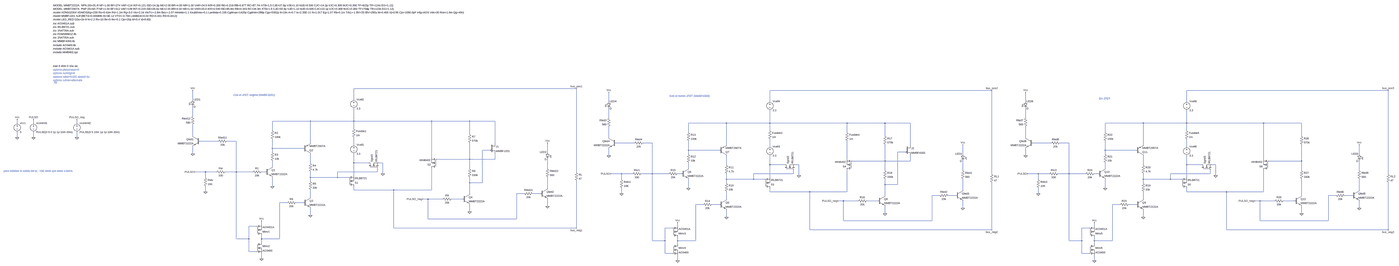
[diagram p0: schematic Prueba JFETs.asc, whole sheet]
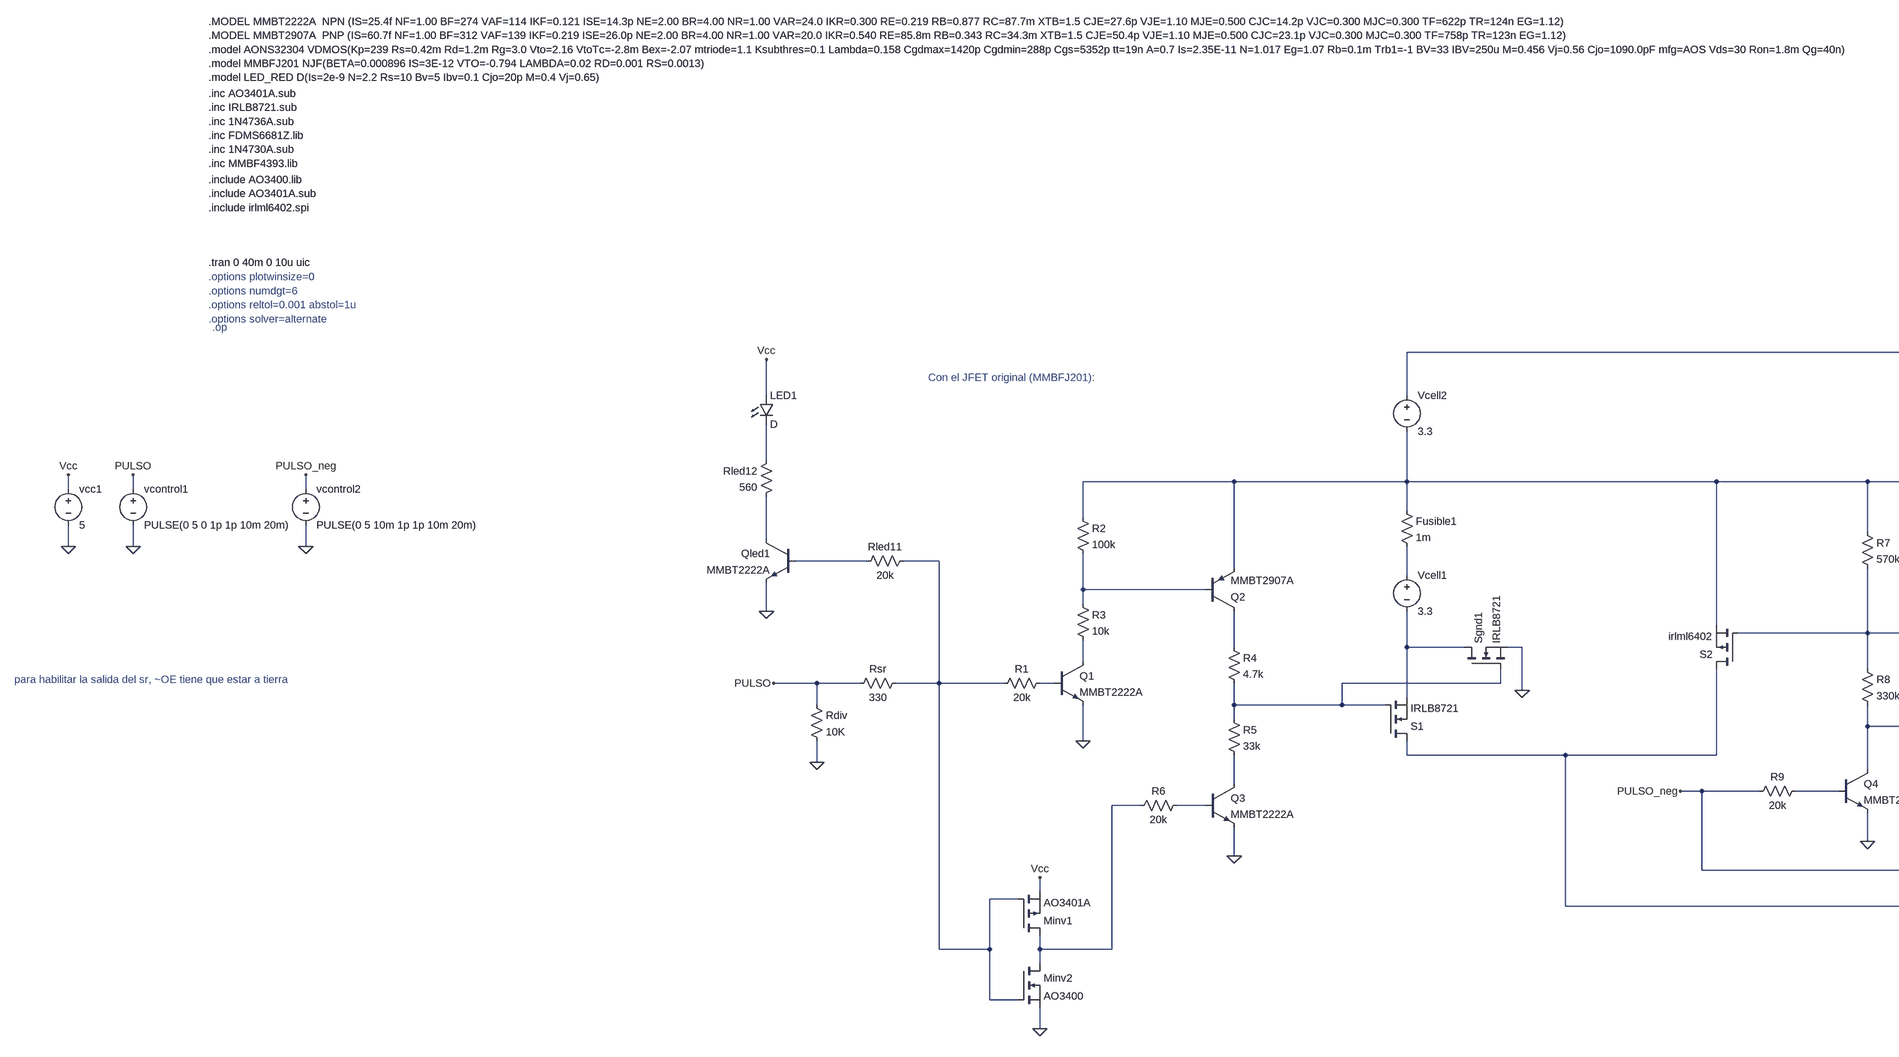
[diagram p1: schematic Prueba JFETs.asc, part, row 1 of 1, column 1 of 3]
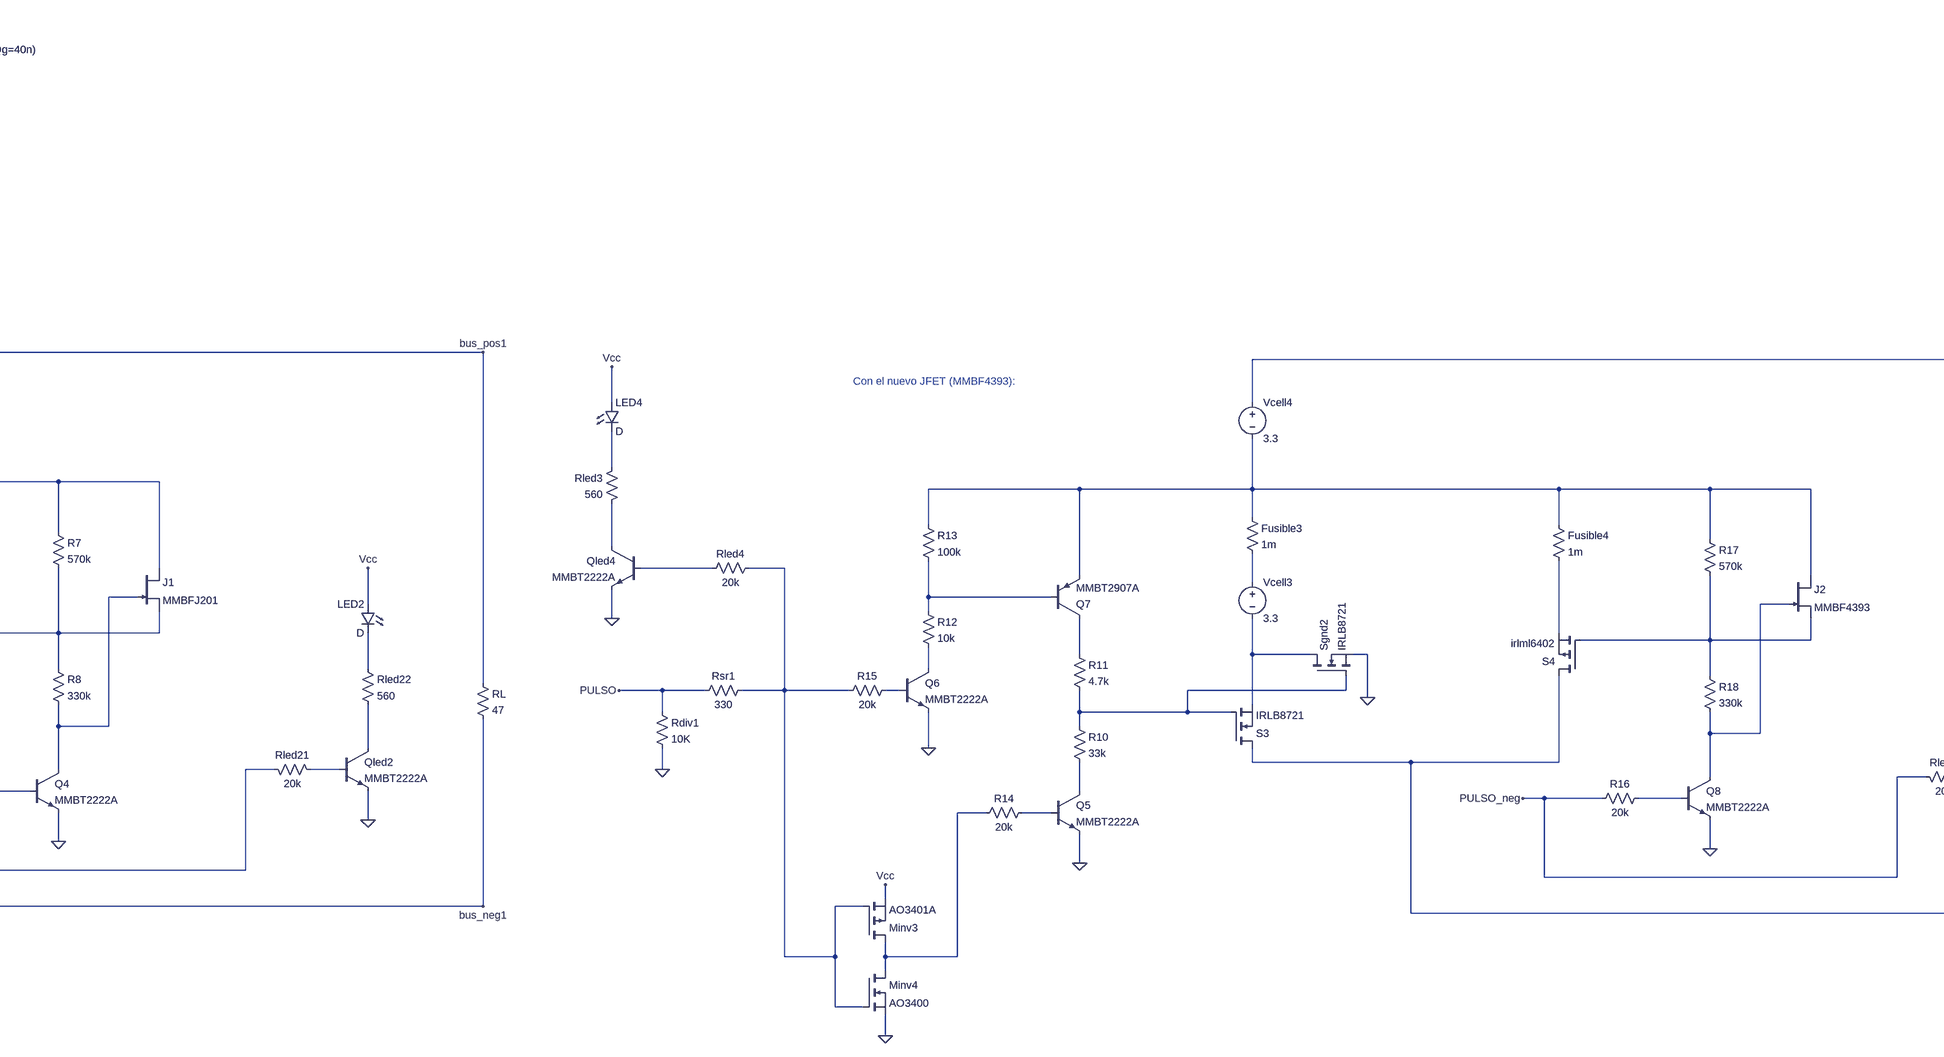
[diagram p2: schematic Prueba JFETs.asc, part, row 1 of 1, column 2 of 3]
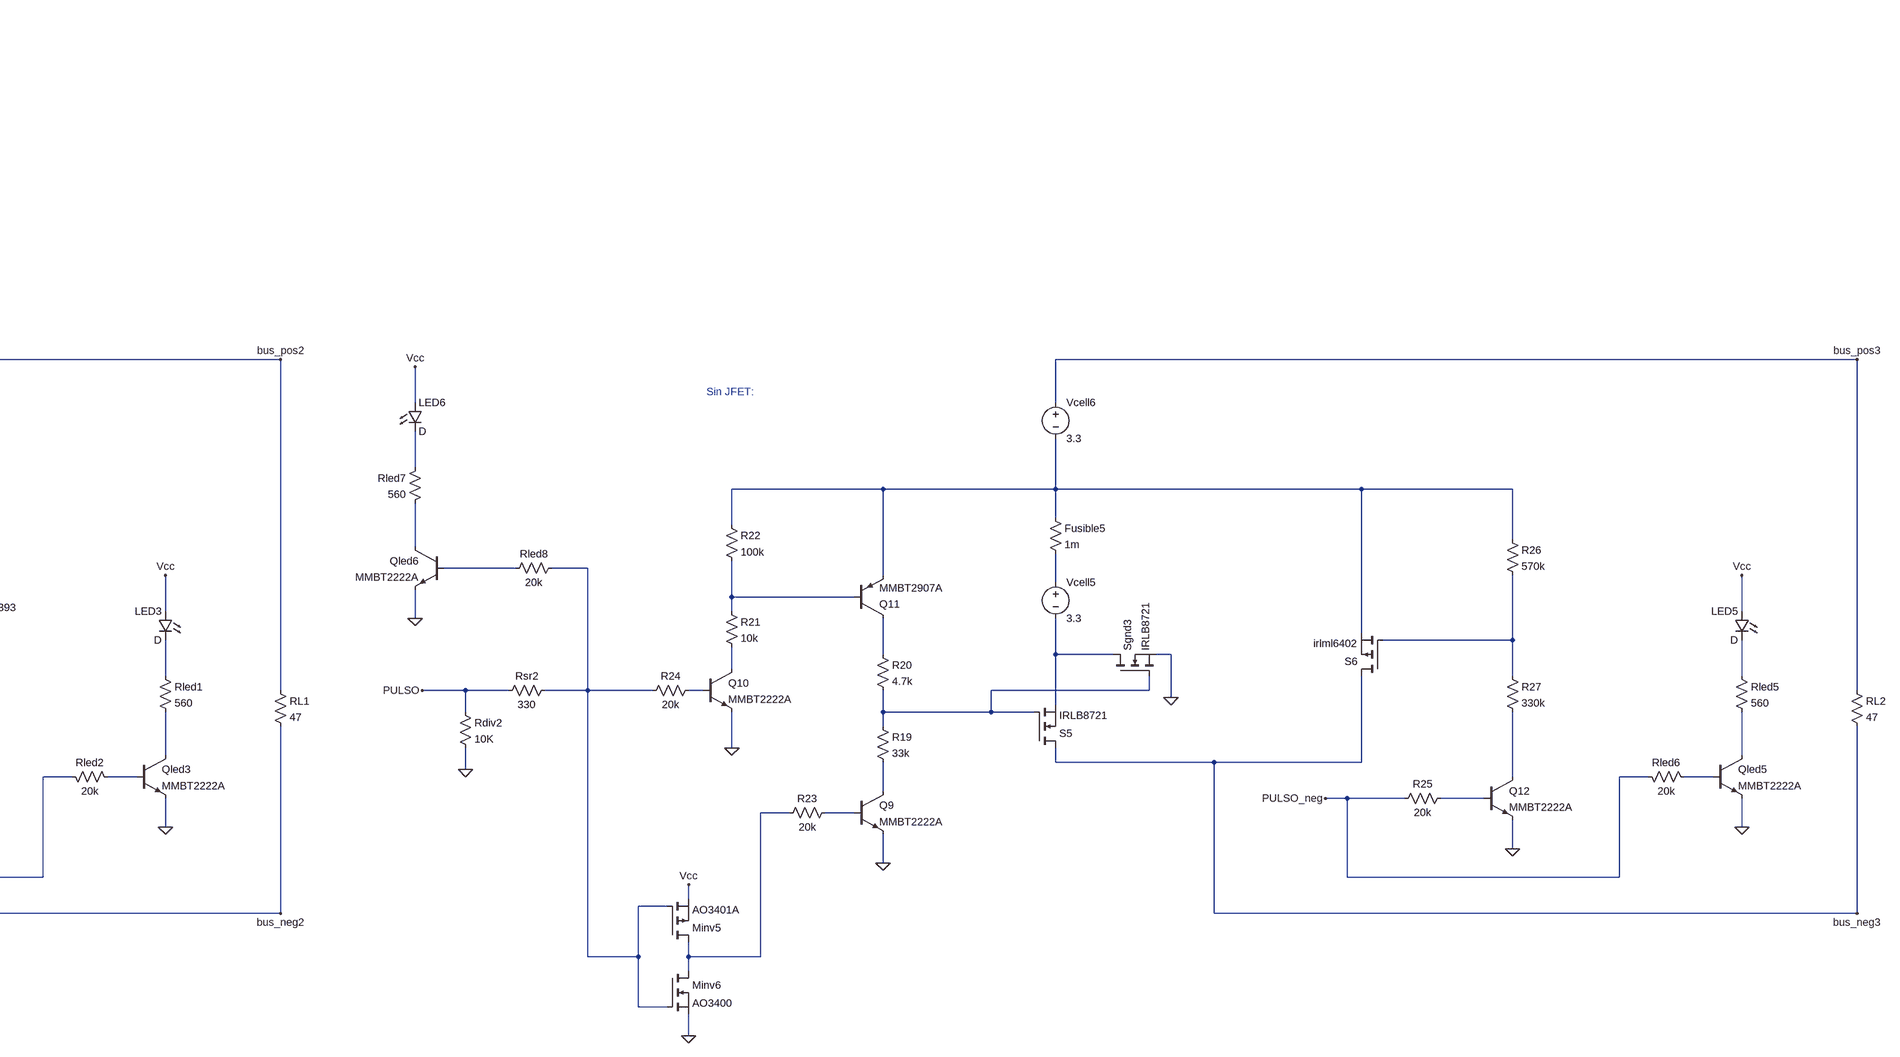
[diagram p3: schematic Prueba JFETs.asc, part, row 1 of 1, column 3 of 3]
Prueba JFETs.asc, the LTspice schematic file:
Version 4.1
SHEET 1 12888 680
WIRE 5040 -1104 3072 -1104
WIRE 8960 -1088 6992 -1088
WIRE 12816 -1088 10848 -1088
WIRE 1648 -1008 1648 -1088
WIRE 3072 -1008 3072 -1104
WIRE 5568 -992 5568 -1072
WIRE 6992 -992 6992 -1088
WIRE 9424 -992 9424 -1072
WIRE 10848 -992 10848 -1088
WIRE 1648 -864 1648 -944
WIRE 5568 -848 5568 -928
WIRE 9424 -848 9424 -928
WIRE 2688 -816 2352 -816
WIRE 3072 -816 3072 -928
WIRE 3072 -816 2688 -816
WIRE 3760 -816 3072 -816
WIRE 4096 -816 3760 -816
WIRE 4320 -816 4096 -816
WIRE 96 -800 96 -832
WIRE 240 -800 240 -832
WIRE 624 -800 624 -832
WIRE 6608 -800 6272 -800
WIRE 6992 -800 6992 -912
WIRE 6992 -800 6608 -800
WIRE 7680 -800 6992 -800
WIRE 8016 -800 7680 -800
WIRE 8240 -800 8016 -800
WIRE 10464 -800 10128 -800
WIRE 10848 -800 10848 -912
WIRE 10848 -800 10464 -800
WIRE 11536 -800 10848 -800
WIRE 11872 -800 11536 -800
WIRE 3072 -752 3072 -816
WIRE 2352 -736 2352 -816
WIRE 6992 -736 6992 -800
WIRE 10848 -736 10848 -800
WIRE 6272 -720 6272 -800
WIRE 7680 -720 7680 -800
WIRE 10128 -720 10128 -800
WIRE 4096 -704 4096 -816
WIRE 1648 -688 1648 -784
WIRE 8016 -688 8016 -800
WIRE 11872 -688 11872 -800
WIRE 96 -672 96 -720
WIRE 240 -672 240 -720
WIRE 624 -672 624 -720
WIRE 5568 -672 5568 -768
WIRE 9424 -672 9424 -768
WIRE 1872 -640 1712 -640
WIRE 2032 -640 1952 -640
WIRE 2688 -624 2688 -816
WIRE 4320 -624 4320 -816
WIRE 5792 -624 5632 -624
WIRE 5952 -624 5872 -624
WIRE 9648 -624 9488 -624
WIRE 9808 -624 9728 -624
WIRE 3072 -608 3072 -672
WIRE 6608 -608 6608 -800
WIRE 8240 -608 8240 -800
WIRE 10464 -608 10464 -800
WIRE 6992 -592 6992 -656
WIRE 10848 -592 10848 -656
WIRE 2352 -576 2352 -656
WIRE 2624 -576 2352 -576
WIRE 4272 -560 4208 -560
WIRE 6272 -560 6272 -640
WIRE 6544 -560 6272 -560
WIRE 10128 -560 10128 -640
WIRE 10400 -560 10128 -560
WIRE 2352 -544 2352 -576
WIRE 4784 -544 4784 -624
WIRE 8192 -544 8128 -544
WIRE 1648 -528 1648 -592
WIRE 6272 -528 6272 -560
WIRE 8704 -528 8704 -608
WIRE 10128 -528 10128 -560
WIRE 12560 -528 12560 -608
WIRE 5568 -512 5568 -576
WIRE 9424 -512 9424 -576
WIRE 3760 -496 3760 -816
WIRE 4096 -480 4096 -624
WIRE 4096 -480 3808 -480
WIRE 4320 -480 4320 -528
WIRE 4320 -480 4096 -480
WIRE 7680 -480 7680 -640
WIRE 11536 -480 11536 -800
WIRE 8016 -464 8016 -608
WIRE 8016 -464 7728 -464
WIRE 8240 -464 8240 -512
WIRE 8240 -464 8016 -464
WIRE 11872 -464 11872 -608
WIRE 11872 -464 11584 -464
WIRE 2688 -448 2688 -528
WIRE 3072 -448 3072 -528
WIRE 3200 -448 3072 -448
WIRE 3328 -448 3296 -448
WIRE 6608 -432 6608 -512
WIRE 6992 -432 6992 -512
WIRE 7120 -432 6992 -432
WIRE 7248 -432 7216 -432
WIRE 10464 -432 10464 -512
WIRE 10848 -432 10848 -512
WIRE 10976 -432 10848 -432
WIRE 11104 -432 11072 -432
WIRE 2352 -416 2352 -464
WIRE 4096 -400 4096 -480
WIRE 4784 -400 4784 -480
WIRE 6272 -400 6272 -448
WIRE 10128 -400 10128 -448
WIRE 8016 -384 8016 -464
WIRE 8704 -384 8704 -464
WIRE 11872 -384 11872 -464
WIRE 12560 -384 12560 -464
WIRE 1760 -368 1664 -368
WIRE 1856 -368 1760 -368
WIRE 2032 -368 2032 -640
WIRE 2032 -368 1936 -368
WIRE 2176 -368 2032 -368
WIRE 2288 -368 2256 -368
WIRE 3280 -368 3280 -400
WIRE 3280 -368 2928 -368
WIRE 5040 -368 5040 -1104
WIRE 3328 -352 3328 -448
WIRE 5680 -352 5584 -352
WIRE 5776 -352 5680 -352
WIRE 5952 -352 5952 -624
WIRE 5952 -352 5856 -352
WIRE 6096 -352 5952 -352
WIRE 6208 -352 6176 -352
WIRE 7200 -352 7200 -384
WIRE 7200 -352 6848 -352
WIRE 8960 -352 8960 -1088
WIRE 9536 -352 9440 -352
WIRE 9632 -352 9536 -352
WIRE 9808 -352 9808 -624
WIRE 9808 -352 9712 -352
WIRE 9952 -352 9808 -352
WIRE 10064 -352 10032 -352
WIRE 11056 -352 11056 -384
WIRE 11056 -352 10704 -352
WIRE 12816 -352 12816 -1088
WIRE 3072 -336 3072 -448
WIRE 7248 -336 7248 -432
WIRE 11104 -336 11104 -432
WIRE 1760 -320 1760 -368
WIRE 2688 -320 2688 -368
WIRE 2928 -320 2928 -368
WIRE 2928 -320 2688 -320
WIRE 3024 -320 2928 -320
WIRE 6992 -320 6992 -432
WIRE 10848 -320 10848 -432
WIRE 5680 -304 5680 -352
WIRE 6608 -304 6608 -352
WIRE 6848 -304 6848 -352
WIRE 6848 -304 6608 -304
WIRE 6944 -304 6848 -304
WIRE 9536 -304 9536 -352
WIRE 10464 -304 10464 -352
WIRE 10704 -304 10704 -352
WIRE 10704 -304 10464 -304
WIRE 10800 -304 10704 -304
WIRE 2688 -288 2688 -320
WIRE 4096 -272 4096 -320
WIRE 4208 -272 4208 -560
WIRE 4208 -272 4096 -272
WIRE 6608 -272 6608 -304
WIRE 10464 -272 10464 -304
WIRE 8016 -256 8016 -304
WIRE 8128 -256 8128 -544
WIRE 8128 -256 8016 -256
WIRE 2352 -240 2352 -320
WIRE 4784 -224 4784 -320
WIRE 6272 -224 6272 -304
WIRE 10128 -224 10128 -304
WIRE 3072 -208 3072 -240
WIRE 3424 -208 3072 -208
WIRE 3760 -208 3760 -400
WIRE 3760 -208 3424 -208
WIRE 8704 -208 8704 -304
WIRE 12560 -208 12560 -304
WIRE 1760 -192 1760 -240
WIRE 6992 -192 6992 -224
WIRE 7344 -192 6992 -192
WIRE 7680 -192 7680 -384
WIRE 7680 -192 7344 -192
WIRE 10848 -192 10848 -224
WIRE 11200 -192 10848 -192
WIRE 11536 -192 11536 -384
WIRE 11536 -192 11200 -192
WIRE 4096 -176 4096 -272
WIRE 4576 -176 4512 -176
WIRE 4720 -176 4656 -176
WIRE 5680 -176 5680 -224
WIRE 9536 -176 9536 -224
WIRE 8016 -160 8016 -256
WIRE 8496 -160 8432 -160
WIRE 8640 -160 8576 -160
WIRE 11872 -160 11872 -304
WIRE 12352 -160 12288 -160
WIRE 12496 -160 12432 -160
WIRE 2688 -144 2688 -208
WIRE 3728 -128 3680 -128
WIRE 3856 -128 3728 -128
WIRE 4032 -128 3936 -128
WIRE 6608 -128 6608 -192
WIRE 10464 -128 10464 -192
WIRE 7648 -112 7600 -112
WIRE 7776 -112 7648 -112
WIRE 7952 -112 7856 -112
WIRE 11504 -112 11456 -112
WIRE 11632 -112 11504 -112
WIRE 11808 -112 11712 -112
WIRE 2480 -96 2416 -96
WIRE 2624 -96 2560 -96
WIRE 6400 -80 6336 -80
WIRE 6544 -80 6480 -80
WIRE 10256 -80 10192 -80
WIRE 10400 -80 10336 -80
WIRE 4784 -64 4784 -128
WIRE 8704 -48 8704 -112
WIRE 12560 -48 12560 -112
WIRE 4096 -16 4096 -80
WIRE 8016 0 8016 -64
WIRE 11872 0 11872 -64
WIRE 2688 16 2688 -48
WIRE 6608 32 6608 -32
WIRE 10464 32 10464 -32
WIRE 3728 48 3728 -128
WIRE 4512 48 4512 -176
WIRE 4512 48 3728 48
WIRE 7648 64 7648 -112
WIRE 8432 64 8432 -160
WIRE 8432 64 7648 64
WIRE 11504 64 11504 -112
WIRE 12288 64 12288 -160
WIRE 12288 64 11504 64
WIRE 2256 96 2256 64
WIRE 2208 112 2144 112
WIRE 6176 112 6176 80
WIRE 10032 112 10032 80
WIRE 3424 128 3424 -208
WIRE 5040 128 5040 -288
WIRE 5040 128 3424 128
WIRE 6128 128 6064 128
WIRE 9984 128 9920 128
WIRE 7344 144 7344 -192
WIRE 8960 144 8960 -272
WIRE 8960 144 7344 144
WIRE 11200 144 11200 -192
WIRE 12816 144 12816 -272
WIRE 12816 144 11200 144
WIRE 2032 224 2032 -368
WIRE 2144 224 2144 112
WIRE 2144 224 2032 224
WIRE 2256 224 2256 192
WIRE 2416 224 2416 -96
WIRE 2416 224 2256 224
WIRE 5952 240 5952 -352
WIRE 6064 240 6064 128
WIRE 6064 240 5952 240
WIRE 6176 240 6176 208
WIRE 6336 240 6336 -80
WIRE 6336 240 6176 240
WIRE 9808 240 9808 -352
WIRE 9920 240 9920 128
WIRE 9920 240 9808 240
WIRE 10032 240 10032 208
WIRE 10192 240 10192 -80
WIRE 10192 240 10032 240
WIRE 2256 256 2256 224
WIRE 6176 272 6176 240
WIRE 10032 272 10032 240
WIRE 2144 336 2144 224
WIRE 2208 336 2144 336
WIRE 6064 352 6064 240
WIRE 6128 352 6064 352
WIRE 9920 352 9920 240
WIRE 9984 352 9920 352
WIRE 2256 400 2256 352
WIRE 6176 416 6176 368
WIRE 10032 416 10032 368
FLAG 240 -672 0
FLAG 96 -672 0
FLAG 96 -832 Vcc
FLAG 240 -832 PULSO
FLAG 1760 -192 0
FLAG 2352 -240 0
FLAG 2688 16 0
FLAG 5040 -1104 bus_pos1
FLAG 4096 -16 0
FLAG 3328 -352 0
FLAG 4784 -64 0
FLAG 4784 -624 Vcc
FLAG 1648 -528 0
FLAG 1648 -1088 Vcc
FLAG 2256 400 0
FLAG 2256 64 Vcc
FLAG 5040 128 bus_neg1
FLAG 1664 -368 PULSO
FLAG 624 -672 0
FLAG 624 -832 PULSO_neg
FLAG 3680 -128 PULSO_neg
FLAG 5680 -176 0
FLAG 6272 -224 0
FLAG 6608 32 0
FLAG 8960 -1088 bus_pos2
FLAG 8016 0 0
FLAG 7248 -336 0
FLAG 8704 -48 0
FLAG 8704 -608 Vcc
FLAG 5568 -512 0
FLAG 5568 -1072 Vcc
FLAG 6176 416 0
FLAG 6176 80 Vcc
FLAG 8960 144 bus_neg2
FLAG 5584 -352 PULSO
FLAG 7600 -112 PULSO_neg
FLAG 9536 -176 0
FLAG 10128 -224 0
FLAG 10464 32 0
FLAG 12816 -1088 bus_pos3
FLAG 11872 0 0
FLAG 11104 -336 0
FLAG 12560 -48 0
FLAG 12560 -608 Vcc
FLAG 9424 -512 0
FLAG 9424 -1072 Vcc
FLAG 10032 416 0
FLAG 10032 80 Vcc
FLAG 12816 144 bus_neg3
FLAG 9440 -352 PULSO
FLAG 11456 -112 PULSO_neg
SYMBOL voltage 240 -816 R0
WINDOW 123 0 0 Left 0
WINDOW 39 0 0 Left 0
SYMATTR InstName vcontrol1
SYMATTR Value PULSE(0 5 0 1p 1p 10m 20m)
SYMBOL voltage 96 -816 R0
WINDOW 123 0 0 Left 0
WINDOW 39 0 0 Left 0
SYMATTR InstName vcc1
SYMATTR Value 5
SYMBOL res 1744 -336 R0
SYMATTR InstName Rdiv
SYMATTR Value 10K
SYMBOL npn 2624 -144 R0
SYMATTR InstName Q3
SYMATTR Value MMBT2222A
SYMBOL res 2672 -304 R0
SYMATTR InstName R5
SYMATTR Value 33k
SYMBOL res 2672 -464 R0
SYMATTR InstName R4
SYMATTR Value 4.7k
SYMBOL npn 2288 -416 R0
SYMATTR InstName Q1
SYMATTR Value MMBT2222A
SYMBOL res 2336 -560 R0
SYMATTR InstName R3
SYMATTR Value 10k
SYMBOL res 2336 -752 R0
SYMATTR InstName R2
SYMATTR Value 100k
SYMBOL res 2576 -112 R90
WINDOW 0 0 56 VBottom 2
WINDOW 3 32 56 VTop 2
SYMATTR InstName R6
SYMATTR Value 20k
SYMBOL voltage 3072 -624 R0
WINDOW 123 0 0 Left 0
WINDOW 39 0 0 Left 0
SYMATTR InstName Vcell1
SYMATTR Value 3.3
SYMBOL pnp 2624 -528 M180
SYMATTR InstName Q2
SYMATTR Value MMBT2907A
SYMBOL nmos 3024 -240 M180
SYMATTR InstName S1
SYMATTR Value IRLB8721
SYMATTR Prefix X
SYMBOL res 2272 -384 R90
WINDOW 0 0 56 VBottom 2
WINDOW 3 32 56 VTop 2
SYMATTR InstName R1
SYMATTR Value 20k
SYMBOL res 3056 -768 R0
SYMATTR InstName Fusible1
SYMATTR Value 1m
SYMBOL npn 4032 -176 R0
SYMATTR InstName Q4
SYMATTR Value MMBT2222A
SYMBOL res 3952 -144 R90
WINDOW 0 0 56 VBottom 2
WINDOW 3 32 56 VTop 2
SYMATTR InstName R9
SYMATTR Value 20k
SYMBOL res 4080 -720 R0
SYMATTR InstName R7
SYMATTR Value 570k
SYMBOL nmos 3200 -400 R270
SYMATTR InstName Sgnd1
SYMATTR Value IRLB8721
SYMATTR Prefix X
SYMBOL pmos 3808 -400 R180
SYMATTR InstName S2
SYMATTR Value irlml6402
SYMATTR Prefix X
SYMBOL npn 4720 -224 R0
SYMATTR InstName Qled2
SYMATTR Value MMBT2222A
SYMBOL res 4768 -416 R0
SYMATTR InstName Rled22
SYMATTR Value 560
SYMBOL res 4560 -192 M90
WINDOW 0 0 56 VBottom 2
WINDOW 3 32 56 VTop 2
SYMATTR InstName Rled21
SYMATTR Value 20k
SYMBOL LED 4800 -544 M0
SYMATTR InstName LED2
SYMBOL res 4080 -416 R0
SYMATTR InstName R8
SYMATTR Value 330k
SYMBOL npn 1712 -688 M0
SYMATTR InstName Qled1
SYMATTR Value MMBT2222A
SYMBOL res 1664 -880 M0
SYMATTR InstName Rled12
SYMATTR Value 560
SYMBOL LED 1632 -1008 R0
SYMATTR InstName LED1
SYMBOL res 1968 -656 R90
WINDOW 0 0 56 VBottom 2
WINDOW 3 32 56 VTop 2
SYMATTR InstName Rled11
SYMATTR Value 20k
SYMBOL pmos 2208 192 M180
SYMATTR InstName Minv1
SYMATTR Value AO3401A
SYMATTR Prefix X
SYMBOL nmos 2208 256 R0
SYMATTR InstName Minv2
SYMATTR Value AO3400
SYMATTR Prefix X
SYMBOL res 1952 -384 R90
WINDOW 0 0 56 VBottom 2
WINDOW 3 32 56 VTop 2
SYMATTR InstName Rsr
SYMATTR Value 330
SYMBOL res 5024 -384 R0
SYMATTR InstName RL
SYMATTR Value 47
SYMBOL njf 4272 -624 R0
SYMATTR InstName J1
SYMATTR Value MMBFJ201
SYMBOL voltage 3072 -1024 R0
WINDOW 123 0 0 Left 0
WINDOW 39 0 0 Left 0
SYMATTR InstName Vcell2
SYMATTR Value 3.3
SYMBOL voltage 624 -816 R0
WINDOW 123 0 0 Left 0
WINDOW 39 0 0 Left 0
SYMATTR InstName vcontrol2
SYMATTR Value PULSE(0 5 10m 1p 1p 10m 20m)
SYMBOL njf 8192 -608 R0
SYMATTR InstName J2
SYMATTR Value MMBF4393
SYMBOL res 5664 -320 R0
SYMATTR InstName Rdiv1
SYMATTR Value 10K
SYMBOL npn 6544 -128 R0
SYMATTR InstName Q5
SYMATTR Value MMBT2222A
SYMBOL res 6592 -288 R0
SYMATTR InstName R10
SYMATTR Value 33k
SYMBOL res 6592 -448 R0
SYMATTR InstName R11
SYMATTR Value 4.7k
SYMBOL npn 6208 -400 R0
SYMATTR InstName Q6
SYMATTR Value MMBT2222A
SYMBOL res 6256 -544 R0
SYMATTR InstName R12
SYMATTR Value 10k
SYMBOL res 6256 -736 R0
SYMATTR InstName R13
SYMATTR Value 100k
SYMBOL res 6496 -96 R90
WINDOW 0 0 56 VBottom 2
WINDOW 3 32 56 VTop 2
SYMATTR InstName R14
SYMATTR Value 20k
SYMBOL voltage 6992 -608 R0
WINDOW 123 0 0 Left 0
WINDOW 39 0 0 Left 0
SYMATTR InstName Vcell3
SYMATTR Value 3.3
SYMBOL pnp 6544 -512 M180
SYMATTR InstName Q7
SYMATTR Value MMBT2907A
SYMBOL nmos 6944 -224 M180
SYMATTR InstName S3
SYMATTR Value IRLB8721
SYMATTR Prefix X
SYMBOL res 6192 -368 R90
WINDOW 0 0 56 VBottom 2
WINDOW 3 32 56 VTop 2
SYMATTR InstName R15
SYMATTR Value 20k
SYMBOL res 6976 -752 R0
SYMATTR InstName Fusible3
SYMATTR Value 1m
SYMBOL npn 7952 -160 R0
SYMATTR InstName Q8
SYMATTR Value MMBT2222A
SYMBOL res 7872 -128 R90
WINDOW 0 0 56 VBottom 2
WINDOW 3 32 56 VTop 2
SYMATTR InstName R16
SYMATTR Value 20k
SYMBOL res 8000 -704 R0
SYMATTR InstName R17
SYMATTR Value 570k
SYMBOL nmos 7120 -384 R270
SYMATTR InstName Sgnd2
SYMATTR Value IRLB8721
SYMATTR Prefix X
SYMBOL pmos 7728 -384 R180
SYMATTR InstName S4
SYMATTR Value irlml6402
SYMATTR Prefix X
SYMBOL npn 8640 -208 R0
SYMATTR InstName Qled3
SYMATTR Value MMBT2222A
SYMBOL res 8688 -400 R0
SYMATTR InstName Rled1
SYMATTR Value 560
SYMBOL res 8480 -176 M90
WINDOW 0 0 56 VBottom 2
WINDOW 3 32 56 VTop 2
SYMATTR InstName Rled2
SYMATTR Value 20k
SYMBOL LED 8720 -528 M0
SYMATTR InstName LED3
SYMBOL res 8000 -400 R0
SYMATTR InstName R18
SYMATTR Value 330k
SYMBOL npn 5632 -672 M0
SYMATTR InstName Qled4
SYMATTR Value MMBT2222A
SYMBOL res 5584 -864 M0
SYMATTR InstName Rled3
SYMATTR Value 560
SYMBOL LED 5552 -992 R0
SYMATTR InstName LED4
SYMBOL res 5888 -640 R90
WINDOW 0 0 56 VBottom 2
WINDOW 3 32 56 VTop 2
SYMATTR InstName Rled4
SYMATTR Value 20k
SYMBOL pmos 6128 208 M180
SYMATTR InstName Minv3
SYMATTR Value AO3401A
SYMATTR Prefix X
SYMBOL nmos 6128 272 R0
SYMATTR InstName Minv4
SYMATTR Value AO3400
SYMATTR Prefix X
SYMBOL res 5872 -368 R90
WINDOW 0 0 56 VBottom 2
WINDOW 3 32 56 VTop 2
SYMATTR InstName Rsr1
SYMATTR Value 330
SYMBOL res 8944 -368 R0
SYMATTR InstName RL1
SYMATTR Value 47
SYMBOL res 7664 -736 R0
SYMATTR InstName Fusible4
SYMATTR Value 1m
SYMBOL voltage 6992 -1008 R0
WINDOW 123 0 0 Left 0
WINDOW 39 0 0 Left 0
SYMATTR InstName Vcell4
SYMATTR Value 3.3
SYMBOL res 9520 -320 R0
SYMATTR InstName Rdiv2
SYMATTR Value 10K
SYMBOL npn 10400 -128 R0
SYMATTR InstName Q9
SYMATTR Value MMBT2222A
SYMBOL res 10448 -288 R0
SYMATTR InstName R19
SYMATTR Value 33k
SYMBOL res 10448 -448 R0
SYMATTR InstName R20
SYMATTR Value 4.7k
SYMBOL npn 10064 -400 R0
SYMATTR InstName Q10
SYMATTR Value MMBT2222A
SYMBOL res 10112 -544 R0
SYMATTR InstName R21
SYMATTR Value 10k
SYMBOL res 10112 -736 R0
SYMATTR InstName R22
SYMATTR Value 100k
SYMBOL res 10352 -96 R90
WINDOW 0 0 56 VBottom 2
WINDOW 3 32 56 VTop 2
SYMATTR InstName R23
SYMATTR Value 20k
SYMBOL voltage 10848 -608 R0
WINDOW 123 0 0 Left 0
WINDOW 39 0 0 Left 0
SYMATTR InstName Vcell5
SYMATTR Value 3.3
SYMBOL pnp 10400 -512 M180
SYMATTR InstName Q11
SYMATTR Value MMBT2907A
SYMBOL nmos 10800 -224 M180
SYMATTR InstName S5
SYMATTR Value IRLB8721
SYMATTR Prefix X
SYMBOL res 10048 -368 R90
WINDOW 0 0 56 VBottom 2
WINDOW 3 32 56 VTop 2
SYMATTR InstName R24
SYMATTR Value 20k
SYMBOL res 10832 -752 R0
SYMATTR InstName Fusible5
SYMATTR Value 1m
SYMBOL npn 11808 -160 R0
SYMATTR InstName Q12
SYMATTR Value MMBT2222A
SYMBOL res 11728 -128 R90
WINDOW 0 0 56 VBottom 2
WINDOW 3 32 56 VTop 2
SYMATTR InstName R25
SYMATTR Value 20k
SYMBOL res 11856 -704 R0
SYMATTR InstName R26
SYMATTR Value 570k
SYMBOL nmos 10976 -384 R270
SYMATTR InstName Sgnd3
SYMATTR Value IRLB8721
SYMATTR Prefix X
SYMBOL pmos 11584 -384 R180
SYMATTR InstName S6
SYMATTR Value irlml6402
SYMATTR Prefix X
SYMBOL npn 12496 -208 R0
SYMATTR InstName Qled5
SYMATTR Value MMBT2222A
SYMBOL res 12544 -400 R0
SYMATTR InstName Rled5
SYMATTR Value 560
SYMBOL res 12336 -176 M90
WINDOW 0 0 56 VBottom 2
WINDOW 3 32 56 VTop 2
SYMATTR InstName Rled6
SYMATTR Value 20k
SYMBOL LED 12576 -528 M0
SYMATTR InstName LED5
SYMBOL res 11856 -400 R0
SYMATTR InstName R27
SYMATTR Value 330k
SYMBOL npn 9488 -672 M0
SYMATTR InstName Qled6
SYMATTR Value MMBT2222A
SYMBOL res 9440 -864 M0
SYMATTR InstName Rled7
SYMATTR Value 560
SYMBOL LED 9408 -992 R0
SYMATTR InstName LED6
SYMBOL res 9744 -640 R90
WINDOW 0 0 56 VBottom 2
WINDOW 3 32 56 VTop 2
SYMATTR InstName Rled8
SYMATTR Value 20k
SYMBOL pmos 9984 208 M180
SYMATTR InstName Minv5
SYMATTR Value AO3401A
SYMATTR Prefix X
SYMBOL nmos 9984 272 R0
SYMATTR InstName Minv6
SYMATTR Value AO3400
SYMATTR Prefix X
SYMBOL res 9728 -368 R90
WINDOW 0 0 56 VBottom 2
WINDOW 3 32 56 VTop 2
SYMATTR InstName Rsr2
SYMATTR Value 330
SYMBOL res 12800 -368 R0
SYMATTR InstName RL2
SYMATTR Value 47
SYMBOL voltage 10848 -1008 R0
WINDOW 123 0 0 Left 0
WINDOW 39 0 0 Left 0
SYMATTR InstName Vcell6
SYMATTR Value 3.3
TEXT 408 -1568 Left 2 !.include AO3400.lib\n.include AO3401A.sub\n.include irlml6402.spi
TEXT -24 -376 Left 2 ;para habilitar la salida del sr, ~OE tiene que estar a tierra
TEXT 408 -1304 Left 2 !.tran 0 40m 0 10u uic
TEXT 408 -1920 Left 2 !.MODEL MMBT2222A  NPN (IS=25.4f NF=1.00 BF=274 VAF=114 IKF=0.121 ISE=14.3p NE=2.00 BR=4.00 NR=1.00 VAR=24.0 IKR=0.300 RE=0.219 RB=0.877 RC=87.7m XTB=1.5 CJE=27.6p VJE=1.10 MJE=0.500 CJC=14.2p VJC=0.300 MJC=0.300 TF=622p TR=124n EG=1.12)\n.MODEL MMBT2907A  PNP (IS=60.7f NF=1.00 BF=312 VAF=139 IKF=0.219 ISE=26.0p NE=2.00 BR=4.00 NR=1.00 VAR=20.0 IKR=0.540 RE=85.8m RB=0.343 RC=34.3m XTB=1.5 CJE=50.4p VJE=1.10 MJE=0.500 CJC=23.1p VJC=0.300 MJC=0.300 TF=758p TR=123n EG=1.12)\n.model AONS32304 VDMOS(Kp=239 Rs=0.42m Rd=1.2m Rg=3.0 Vto=2.16 VtoTc=-2.8m Bex=-2.07 mtriode=1.1 Ksubthres=0.1 Lambda=0.158 Cgdmax=1420p Cgdmin=288p Cgs=5352p tt=19n A=0.7 Is=2.35E-11 N=1.017 Eg=1.07 Rb=0.1m Trb1=-1 BV=33 IBV=250u M=0.456 Vj=0.56 Cjo=1090.0pF mfg=AOS Vds=30 Ron=1.8m Qg=40n)\n.model MMBFJ201 NJF(BETA=0.000896 IS=3E-12 VTO=-0.794 LAMBDA=0.02 RD=0.001 RS=0.0013)\n.model LED_RED D(Is=2e-9 N=2.2 Rs=10 Bv=5 Ibv=0.1 Cjo=20p M=0.4 Vj=0.65)
TEXT 408 -1760 Left 2 !.inc AO3401A.sub\n.inc IRLB8721.sub\n.inc 1N4736A.sub\n.inc FDMS6681Z.lib\n.inc 1N4730A.sub\n.inc MMBF4393.lib
TEXT 408 -1272 Left 2 ;.options plotwinsize=0\n.options numdgt=6\n.options reltol=0.001 abstol=1u\n.options solver=alternate
TEXT 416 -1160 Left 2 ;.op
TEXT 2008 -1048 Left 2 ;Con el JFET original (MMBFJ201):
TEXT 6104 -1040 Left 2 ;Con el nuevo JFET (MMBF4393):
TEXT 10072 -1016 Left 2 ;Sin JFET:

The netlist it stands for:
* Prueba JFETs.asc
vcontrol1 PULSO 0 PULSE(0 5 0 1p 1p 10m 20m)
vcc1 Vcc 0 5
Rdiv PULSO 0 10K
Q3 N053 N060 0 0 MMBT2222A
R5 N041 N053 33k
R4 N028 N041 4.7k
Q1 N034 N040 0 0 MMBT2222A
R3 N019 N034 10k
R2 N004 N019 100k
R6 N060 N059 20k
Vcell1 N016 N029 3.3
Q2 N028 N019 N004 0 MMBT2907A
X§S1 bus_neg1 N041 N029 IRLB8721  ; pins D G S
R1 N040 N011 20k
R§Fusible1 N004 N016 1m
Q4 N020 N054 0 0 MMBT2222A
R9 N054 PULSO_neg 20k
R7 N004 N024 570k
X§Sgnd1 N029 N041 0 IRLB8721  ; pins D G S
X§S2 bus_neg1 N024 N004 irlml6402  ; pins D G S
Qled2 N046 N049 0 0 MMBT2222A
Rled22 N035 N046 560
Rled21 PULSO_neg N049 20k
D§LED2 Vcc N035 D
R8 N024 N020 330k
Qled1 N007 N010 0 0 MMBT2222A
Rled12 N001 N007 560
D§LED1 Vcc N001 D
Rled11 N011 N010 20k
X§Minv1 N059 N011 Vcc AO3401A  ; pins D G S
X§Minv2 N059 N011 0 AO3400  ; pins D G S
Rsr N011 PULSO 330
RL bus_pos1 bus_neg1 47
J1 N004 N020 N024 MMBFJ201
Vcell2 bus_pos1 N004 3.3
vcontrol2 PULSO_neg 0 PULSE(0 5 10m 1p 1p 10m 20m)
J2 N005 N023 N026 MMBF4393
Rdiv1 PULSO 0 10K
Q5 N055 N062 0 0 MMBT2222A
R10 N043 N055 33k
R11 N030 N043 4.7k
Q6 N036 N042 0 0 MMBT2222A
R12 N021 N036 10k
R13 N005 N021 100k
R14 N062 N061 20k
Vcell3 N017 N031 3.3
Q7 N030 N021 N005 0 MMBT2907A
X§S3 bus_neg2 N043 N031 IRLB8721  ; pins D G S
R15 N042 N013 20k
R§Fusible3 N005 N017 1m
Q8 N023 N057 0 0 MMBT2222A
R16 N057 PULSO_neg 20k
R17 N005 N026 570k
X§Sgnd2 N031 N043 0 IRLB8721  ; pins D G S
X§S4 bus_neg2 N026 N025 irlml6402  ; pins D G S
Qled3 N047 N050 0 0 MMBT2222A
Rled1 N038 N047 560
Rled2 PULSO_neg N050 20k
D§LED3 Vcc N038 D
R18 N026 N023 330k
Qled4 N008 N012 0 0 MMBT2222A
Rled3 N002 N008 560
D§LED4 Vcc N002 D
Rled4 N013 N012 20k
X§Minv3 N061 N013 Vcc AO3401A  ; pins D G S
X§Minv4 N061 N013 0 AO3400  ; pins D G S
Rsr1 N013 PULSO 330
RL1 bus_pos2 bus_neg2 47
R§Fusible4 N005 N025 1m
Vcell4 bus_pos2 N005 3.3
Rdiv2 PULSO 0 10K
Q9 N056 N064 0 0 MMBT2222A
R19 N045 N056 33k
R20 N032 N045 4.7k
Q10 N037 N044 0 0 MMBT2222A
R21 N022 N037 10k
R22 N006 N022 100k
R23 N064 N063 20k
Vcell5 N018 N033 3.3
Q11 N032 N022 N006 0 MMBT2907A
X§S5 bus_neg3 N045 N033 IRLB8721  ; pins D G S
R24 N044 N015 20k
R§Fusible5 N006 N018 1m
Q12 N051 N058 0 0 MMBT2222A
R25 N058 PULSO_neg 20k
R26 N006 N027 570k
X§Sgnd3 N033 N045 0 IRLB8721  ; pins D G S
X§S6 bus_neg3 N027 N006 irlml6402  ; pins D G S
Qled5 N048 N052 0 0 MMBT2222A
Rled5 N039 N048 560
Rled6 PULSO_neg N052 20k
D§LED5 Vcc N039 D
R27 N027 N051 330k
Qled6 N009 N014 0 0 MMBT2222A
Rled7 N003 N009 560
D§LED6 Vcc N003 D
Rled8 N015 N014 20k
X§Minv5 N063 N015 Vcc AO3401A  ; pins D G S
X§Minv6 N063 N015 0 AO3400  ; pins D G S
Rsr2 N015 PULSO 330
RL2 bus_pos3 bus_neg3 47
Vcell6 bus_pos3 N006 3.3
.model D D
.lib standard.dio
.model NPN NPN
.model PNP PNP
.lib standard.bjt
.model NJF NJF
.model PJF PJF
.lib standard.jft
.include AO3400.lib
.include AO3401A.sub
.include irlml6402.spi
* para habilitar la salida del sr, ~OE tiene que estar a tierra
.tran 0 40m 0 10u uic
.MODEL MMBT2222A  NPN (IS=25.4f NF=1.00 BF=274 VAF=114 IKF=0.121 ISE=14.3p NE=2.00 BR=4.00 NR=1.00 VAR=24.0 IKR=0.300 RE=0.219 RB=0.877 RC=87.7m XTB=1.5 CJE=27.6p VJE=1.10 MJE=0.500 CJC=14.2p VJC=0.300 MJC=0.300 TF=622p TR=124n EG=1.12)
.MODEL MMBT2907A  PNP (IS=60.7f NF=1.00 BF=312 VAF=139 IKF=0.219 ISE=26.0p NE=2.00 BR=4.00 NR=1.00 VAR=20.0 IKR=0.540 RE=85.8m RB=0.343 RC=34.3m XTB=1.5 CJE=50.4p VJE=1.10 MJE=0.500 CJC=23.1p VJC=0.300 MJC=0.300 TF=758p TR=123n EG=1.12)
.model AONS32304 VDMOS(Kp=239 Rs=0.42m Rd=1.2m Rg=3.0 Vto=2.16 VtoTc=-2.8m Bex=-2.07 mtriode=1.1 Ksubthres=0.1 Lambda=0.158 Cgdmax=1420p Cgdmin=288p Cgs=5352p tt=19n A=0.7 Is=2.35E-11 N=1.017 Eg=1.07 Rb=0.1m Trb1=-1 BV=33 IBV=250u M=0.456 Vj=0.56 Cjo=1090.0pF mfg=AOS Vds=30 Ron=1.8m Qg=40n)
.model MMBFJ201 NJF(BETA=0.000896 IS=3E-12 VTO=-0.794 LAMBDA=0.02 RD=0.001 RS=0.0013)
.model LED_RED D(Is=2e-9 N=2.2 Rs=10 Bv=5 Ibv=0.1 Cjo=20p M=0.4 Vj=0.65)
.inc AO3401A.sub
.inc IRLB8721.sub
.inc 1N4736A.sub
.inc FDMS6681Z.lib
.inc 1N4730A.sub
.inc MMBF4393.lib
* .options plotwinsize=0
* .options numdgt=6
* .options reltol=0.001 abstol=1u
* .options solver=alternate
* .op
* Con el JFET original (MMBFJ201):
* Con el nuevo JFET (MMBF4393):
* Sin JFET:
.backanno
.end